# Altium schematic sheet CPU - Ethernet.SchDoc: Title
size Tabloid; Revision: A; ProjectTitle: CDU: CAN Display Unit
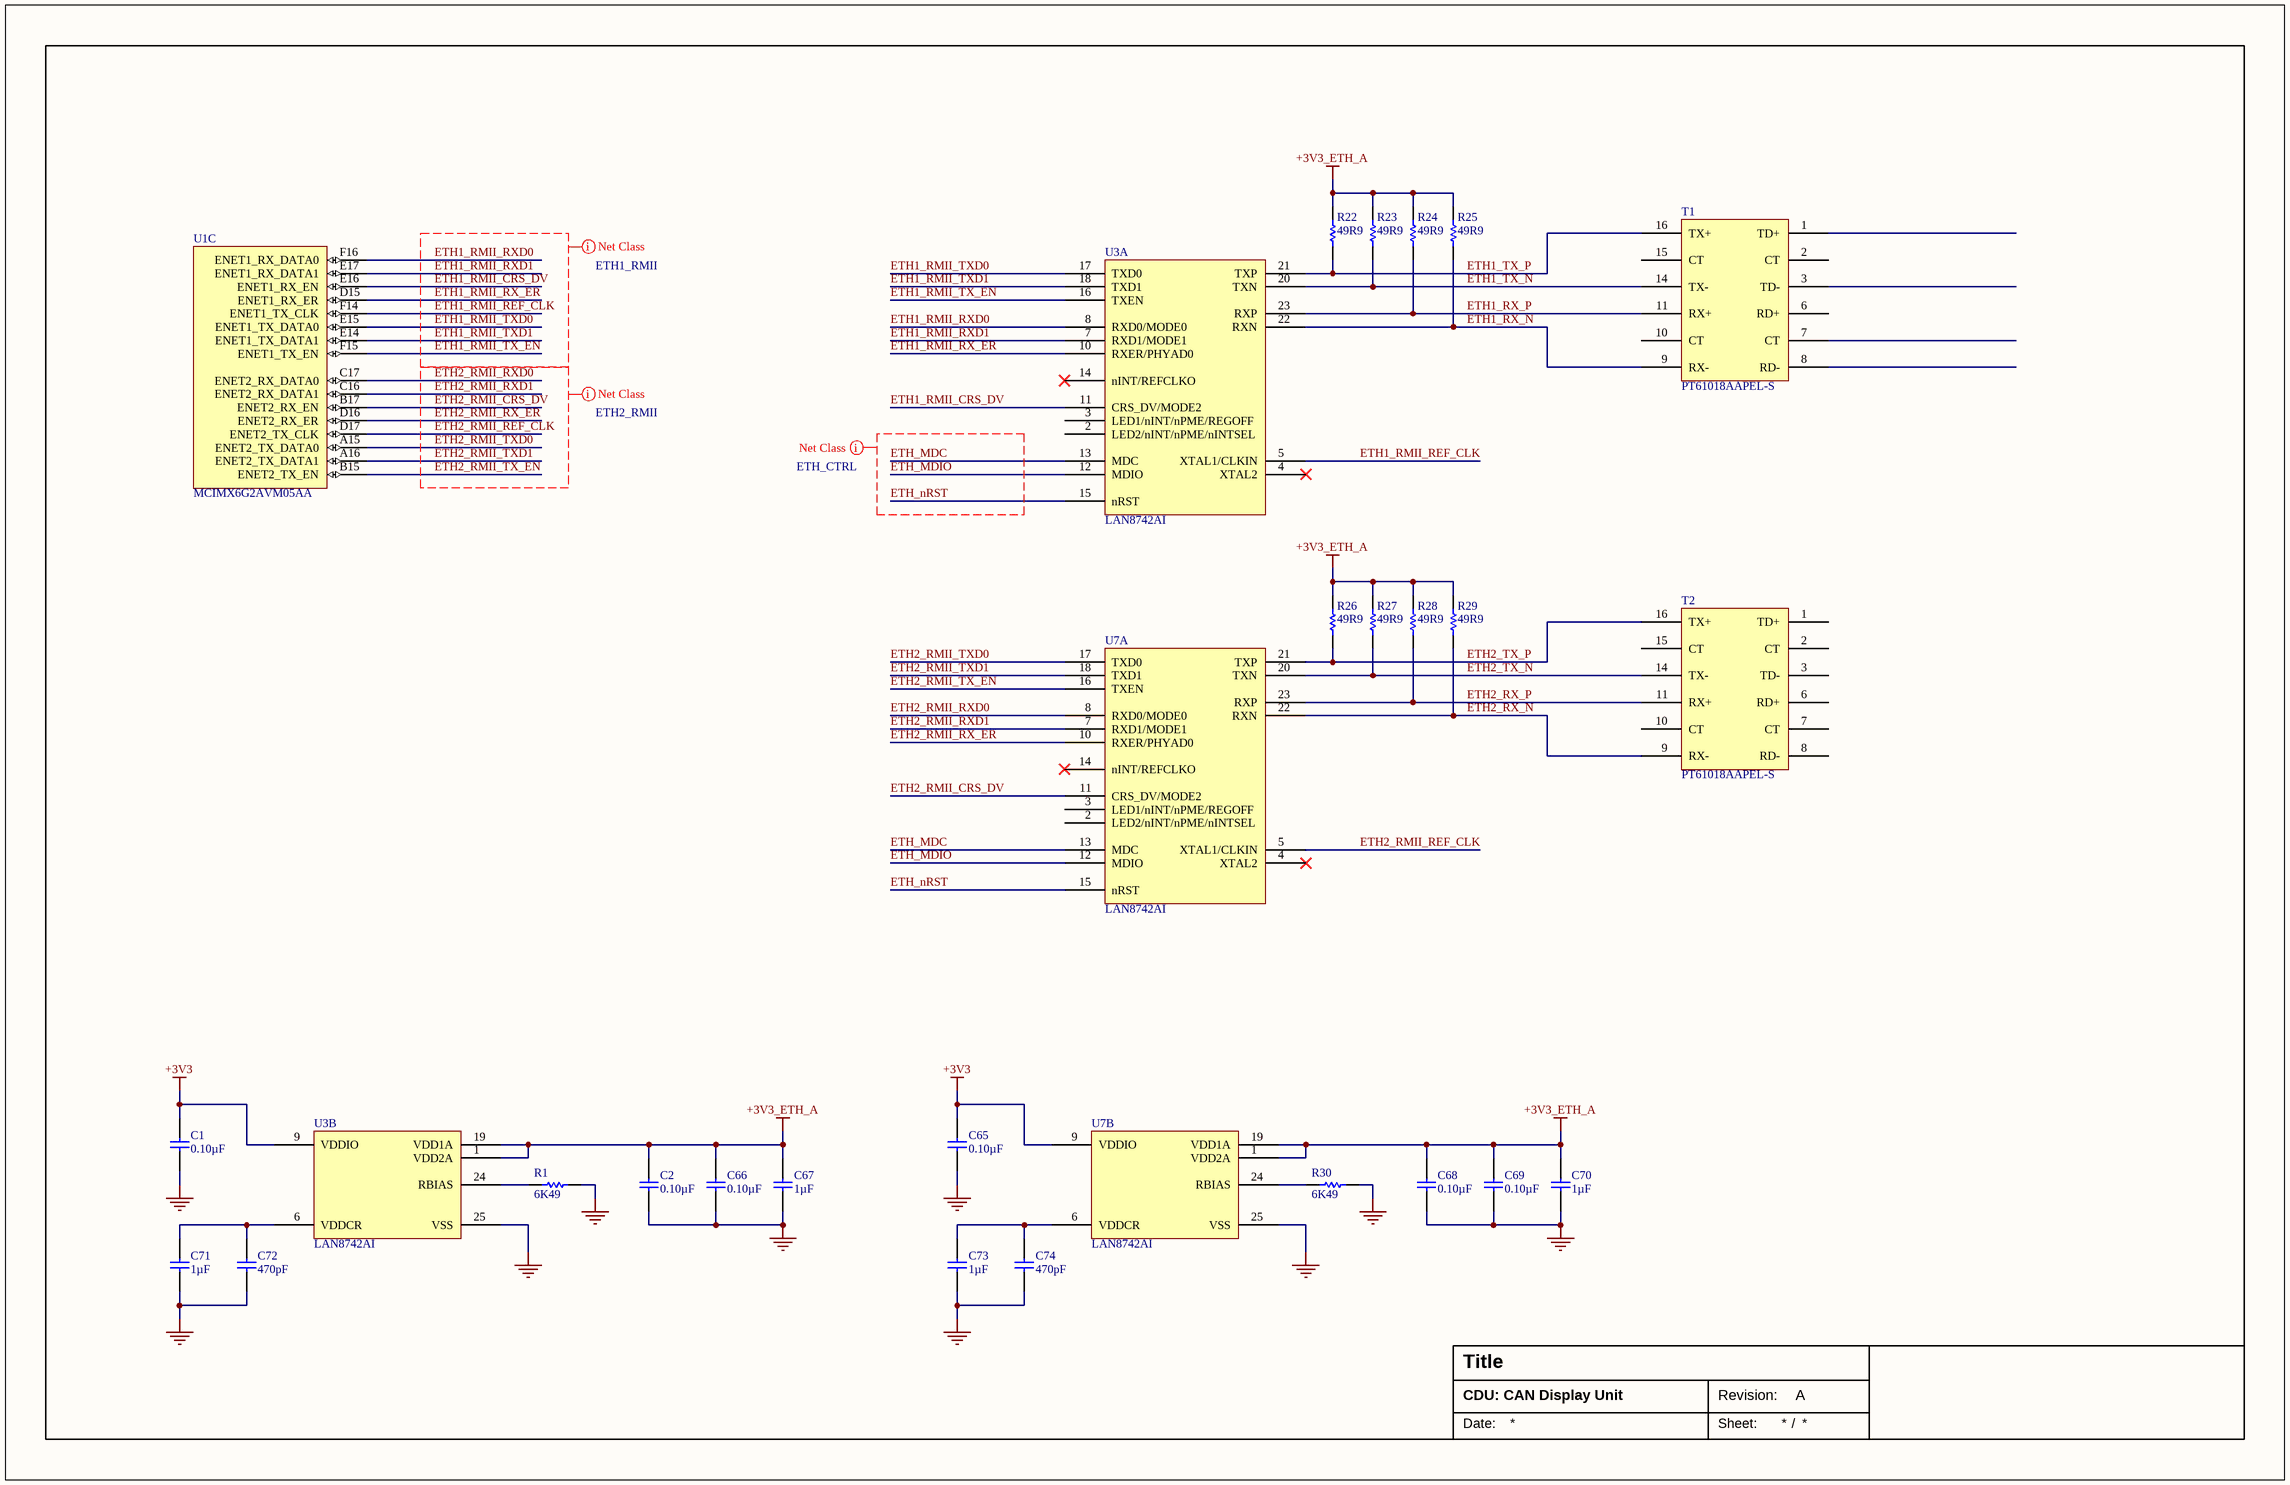
[diagram p0: CPU - Ethernet.SchDoc]

## Parts
C1  value 0.10µF  [CAP-0402-M]  (hidden comment: Capacitor)
C2  value 0.10µF  [CAP-0402-M]  (hidden comment: Capacitor)
C65  value 0.10µF  [CAP-0402-M]  (hidden comment: Capacitor)
C66  value 0.10µF  [CAP-0402-M]  (hidden comment: Capacitor)
C67  value 1µF  [CAP-0402-M]  (hidden comment: CAP 1µF ±10% 6.3V 0402 X7R)
C68  value 0.10µF  [CAP-0402-M]  (hidden comment: Capacitor)
C69  value 0.10µF  [CAP-0402-M]  (hidden comment: Capacitor)
C70  value 1µF  [CAP-0402-M]  (hidden comment: CAP 1µF ±10% 6.3V 0402 X7R)
C71  value 1µF  [CAP-0402-M]  (hidden comment: CAP 1µF ±10% 6.3V 0402 X7R)
C72  value 470pF  [CAP-0402-M]  (hidden comment: CAP 470pF ±5% 50V 0402 C0G, NP0)
C73  value 1µF  [CAP-0402-M]  (hidden comment: CAP 1µF ±10% 6.3V 0402 X7R)
C74  value 470pF  [CAP-0402-M]  (hidden comment: CAP 470pF ±5% 50V 0402 C0G, NP0)
R1  value 6K49  [RES-0603-M]  (hidden comment: Resistor)
R22  value 49R9  [RES-0402-M]  (hidden comment: RES 49R9 1% 1/16W 0402)
R23  value 49R9  [RES-0402-M]  (hidden comment: RES 49R9 1% 1/16W 0402)
R24  value 49R9  [RES-0402-M]  (hidden comment: RES 49R9 1% 1/16W 0402)
R25  value 49R9  [RES-0402-M]  (hidden comment: RES 49R9 1% 1/16W 0402)
R26  value 49R9  [RES-0402-M]  (hidden comment: RES 49R9 1% 1/16W 0402)
R27  value 49R9  [RES-0402-M]  (hidden comment: RES 49R9 1% 1/16W 0402)
R28  value 49R9  [RES-0402-M]  (hidden comment: RES 49R9 1% 1/16W 0402)
R29  value 49R9  [RES-0402-M]  (hidden comment: RES 49R9 1% 1/16W 0402)
R30  value 6K49  [RES-0603-M]  (hidden comment: Resistor)
T1  PT61018AAPEL-S  [SOIC127P930X590-16N]
T2  PT61018AAPEL-S  [SOIC127P930X590-16N]
U1  MCIMX6G2AVM05AA  [BGA289C80P17X17_1400X1400X132]  (part C of 14)
U3  LAN8742AI  [QFN50P400X400X100_HS-25N]  (parts A,B of 2)
U7  LAN8742AI  [QFN50P400X400X100_HS-25N]  (parts A,B of 2)

## Nets
+3V3: C1.2 C65.2 U3.9(VDDIO) U7.9(VDDIO)
+3V3_ETH_A: C2.2 C66.2 C67.2 C68.2 C69.2 C70.2 R22.2 R23.2 R24.2 R25.2 R26.2 R27.2 R28.2 R29.2 U3.1(VDD2A) U3.19(VDD1A) U7.1(VDD2A) U7.19(VDD1A)
GND: C1.1 C2.1 C65.1 C66.1 C67.1 C68.1 C69.1 C70.1 C71.1 C72.1 C73.1 C74.1 R1.1 R30.1 U3.25(VSS) U7.25(VSS)
ETH1_RMII_CRS_DV: U1.E16(ENET1_RX_EN) U3.11(CRS_DV/MODE2)
ETH1_RMII_REF_CLK: U1.F14(ENET1_TX_CLK) U3.5(XTAL1/CLKIN)
ETH1_RMII_RX_ER: U1.D15(ENET1_RX_ER) U3.10(RXER/PHYAD0)
ETH1_RMII_RXD0: U1.F16(ENET1_RX_DATA0) U3.8(RXD0/MODE0)
ETH1_RMII_RXD1: U1.E17(ENET1_RX_DATA1) U3.7(RXD1/MODE1)
ETH1_RMII_TX_EN: U1.F15(ENET1_TX_EN) U3.16(TXEN)
ETH1_RMII_TXD0: U1.E15(ENET1_TX_DATA0) U3.17(TXD0)
ETH1_RMII_TXD1: U1.E14(ENET1_TX_DATA1) U3.18(TXD1)
ETH1_RX_N: R25.1 T1.9(RX-) U3.22(RXN)
ETH1_RX_P: R24.1 T1.11(RX+) U3.23(RXP)
ETH1_TX_N: R23.1 T1.14(TX-) U3.20(TXN)
ETH1_TX_P: R22.1 T1.16(TX+) U3.21(TXP)
ETH2_RMII_CRS_DV: U1.B17(ENET2_RX_EN) U7.11(CRS_DV/MODE2)
ETH2_RMII_REF_CLK: U1.D17(ENET2_TX_CLK) U7.5(XTAL1/CLKIN)
ETH2_RMII_RX_ER: U1.D16(ENET2_RX_ER) U7.10(RXER/PHYAD0)
ETH2_RMII_RXD0: U1.C17(ENET2_RX_DATA0) U7.8(RXD0/MODE0)
ETH2_RMII_RXD1: U1.C16(ENET2_RX_DATA1) U7.7(RXD1/MODE1)
ETH2_RMII_TX_EN: U1.B15(ENET2_TX_EN) U7.16(TXEN)
ETH2_RMII_TXD0: U1.A15(ENET2_TX_DATA0) U7.17(TXD0)
ETH2_RMII_TXD1: U1.A16(ENET2_TX_DATA1) U7.18(TXD1)
ETH2_RX_N: R29.1 T2.9(RX-) U7.22(RXN)
ETH2_RX_P: R28.1 T2.11(RX+) U7.23(RXP)
ETH2_TX_N: R27.1 T2.14(TX-) U7.20(TXN)
ETH2_TX_P: R26.1 T2.16(TX+) U7.21(TXP)
ETH_MDC: U3.13(MDC) U7.13(MDC)
ETH_MDIO: U3.12(MDIO) U7.12(MDIO)
ETH_nRST: U3.15(nRST) U7.15(nRST)
NetC71_2: C71.2 C72.2 U3.6(VDDCR)
NetC73_2: C73.2 C74.2 U7.6(VDDCR)
NetR1_2: R1.2 U3.24(RBIAS)
NetR30_2: R30.2 U7.24(RBIAS)

Not connected (* = marked no-connect by the designer): T1 1(TD+) 2(CT) 3(TD-) 6(RD+) 7(CT) 8(RD-) 10(CT) 15(CT); T2 1(TD+) 2(CT) 3(TD-) 6(RD+) 7(CT) 8(RD-) 10(CT) 15(CT); U3 2(LED2/nINT/nPME/nINTSEL) 3(LED1/nINT/nPME/REGOFF) 4(XTAL2)* 14(nINT/REFCLKO)*; U7 2(LED2/nINT/nPME/nINTSEL) 3(LED1/nINT/nPME/REGOFF) 4(XTAL2)* 14(nINT/REFCLKO)*

## Layout directives
net class ETH1_RMII: ETH1_RMII_CRS_DV, ETH1_RMII_REF_CLK, ETH1_RMII_RX_ER, ETH1_RMII_RXD0, ETH1_RMII_RXD1, ETH1_RMII_TX_EN, ETH1_RMII_TXD0, ETH1_RMII_TXD1
net class ETH2_RMII: ETH2_RMII_CRS_DV, ETH2_RMII_REF_CLK, ETH2_RMII_RX_ER, ETH2_RMII_RXD0, ETH2_RMII_RXD1, ETH2_RMII_TX_EN, ETH2_RMII_TXD0, ETH2_RMII_TXD1
net class ETH_CTRL: ETH_MDC, ETH_MDIO, ETH_nRST

## Notes on the sheet
- Date:
- Revision:
- Sheet:
- /

## Library data of the parts
C1 C2 C65 C66 C68 C69 = CC0402KRX7R8BB104: Manufacturer: Yageo; Manufacturer Series: CC; Tolerance: ±10%; Voltage: 25V; Temperature Coefficient: X7R; Part Number: CC0402KRX7R8BB104; Component Type: Standard; Package: 0402; Temperature Range: -55°C ~ 125°C; Supplier 1: Digi-Key; Supplier Part Number 1: 311-2077-1-ND
C67 C70 C71 C73 = CC0402KRX7R5BB105: Manufacturer: Yageo; Manufacturer Series: CC; Part Number: CC0402KRX7R5BB105; Component Type: Standard; Tolerance: ±10%; Voltage: 6.3V; Package: 0402; Temperature Coefficient: X7R; Temperature Range: -55°C ~ 125°C; Supplier 1: Digi-Key; Supplier Part Number 1: 311-1702-1-ND
C72 C74 = CC0402JRNPO9BN471: Manufacturer: Yageo; Manufacturer Series: CC; Part Number: CC0402JRNPO9BN471; Component Type: Standard; Tolerance: ±5%; Voltage: 50V; Package: 0402; Temperature Coefficient: C0G, NP0; Temperature Range: -55°C ~ 125°C; Supplier 1: Digi-Key; Supplier Part Number 1: 311-1671-1-ND
R1 R30 = RC0603FR-076K49L: Manufacturer: Yageo; Manufacturer Series: RC; Tolerance: 1%; Power: 1/10 W; Temperature Coefficient: ±100ppm/°C; Part Number: RC0603FR-076K49L; Component Type: Standard; Package: 0603; Temperature Range: -55°C ~ 155°C; Supplier 1: Digi-Key; Supplier Part Number 1: 311-6.49KHRCT-ND
R22-R29 = RC0402FR-0749R9L: Manufacturer: Yageo; Manufacturer Series: RC; Part Number: RC0402FR-0749R9L; Component Type: Standard; Tolerance: 1%; Power: 1/16W; Package: 0402; Temperature Range: -55°C ~ 155°C; Supplier 1: Digi-Key; Supplier Part Number 1: 311-49.9LRCT-ND